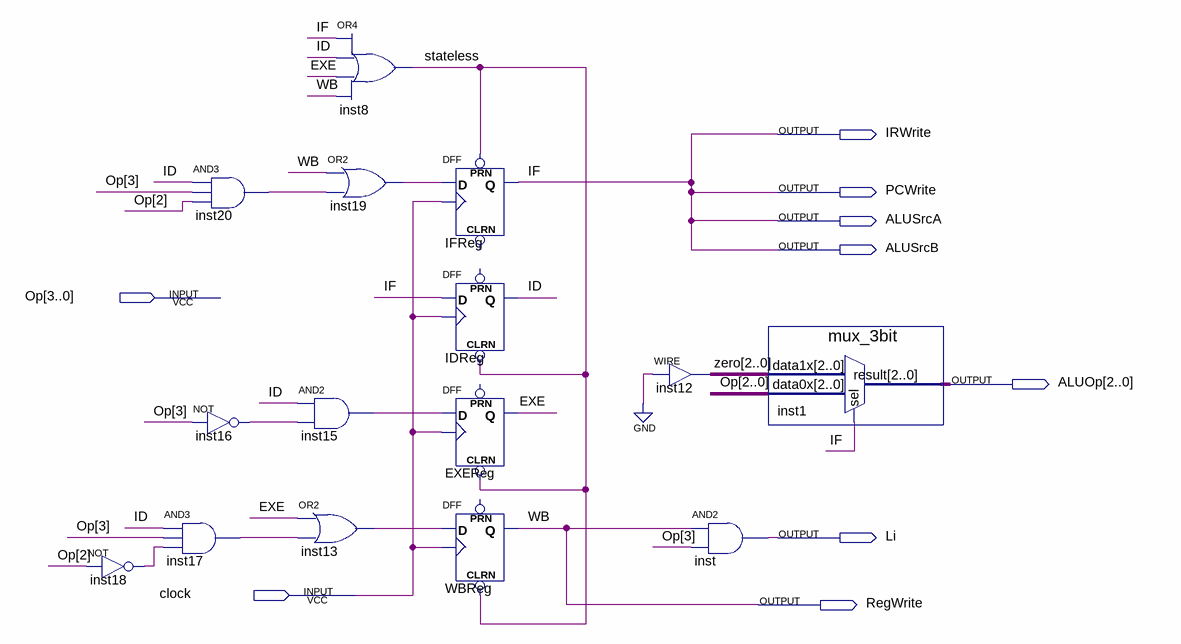
[diagram p0: schematic sheet]
// Quartus schematic Control.bdf as structural Verilog: 15 symbols, 9 pins
module Control (
  input  [3:0] Op,
  input  clock,
  output IRWrite,
  output PCWrite,
  output ALUSrcA,
  output ALUSrcB,
  output [2:0] ALUOp,
  output Li,
  output RegWrite
);

  wire EXE, ID, inst13_out, inst15_out, inst16_out, inst17_out, inst18_out, inst19_out, inst20_out, stateless;
  wire [2:0] zero;

  not inst18 (inst18_out, Op[2]);
  and inst17 (inst17_out, ID, Op[3], inst18_out);
  and inst20 (inst20_out, ID, Op[3], Op[2]);
  not inst16 (inst16_out, Op[3]);
  and inst15 (inst15_out, ID, inst16_out);
  or inst13 (inst13_out, EXE, inst17_out);
  or inst8 (stateless, ALUSrcA, ID, EXE, RegWrite);
  or inst19 (inst19_out, RegWrite, inst20_out);
  DFF IFReg (.CLK(clock), .D(inst19_out), .PRN(stateless), .Q(ALUSrcA));  // open: CLRN
  DFF IDReg (.CLRN(stateless), .CLK(clock), .D(ALUSrcA), .Q(ID));  // open: PRN
  DFF EXEReg (.CLRN(stateless), .CLK(clock), .D(inst15_out), .Q(EXE));  // open: PRN
  DFF WBReg (.CLRN(stateless), .CLK(clock), .D(inst13_out), .Q(RegWrite));  // open: PRN
  assign zero = 3'b000;  // WIRE inst12
  and inst (Li, RegWrite, Op[3]);
  mux_3bit inst1 (.data1x(zero), .data0x(Op[2:0]), .sel(ALUSrcA), .result(ALUOp));

  assign ALUSrcB = ALUSrcA;
  assign IRWrite = ALUSrcA;
  assign PCWrite = ALUSrcA;

  // Other names for the same wires on the sheet: IF = ALUSrcA; WB = RegWrite
endmodule
